# Altium schematic sheet PowerBoard.SchDoc
size A3; DocumentNumber: 5; SheetNumber: 5; SheetTotal: 9
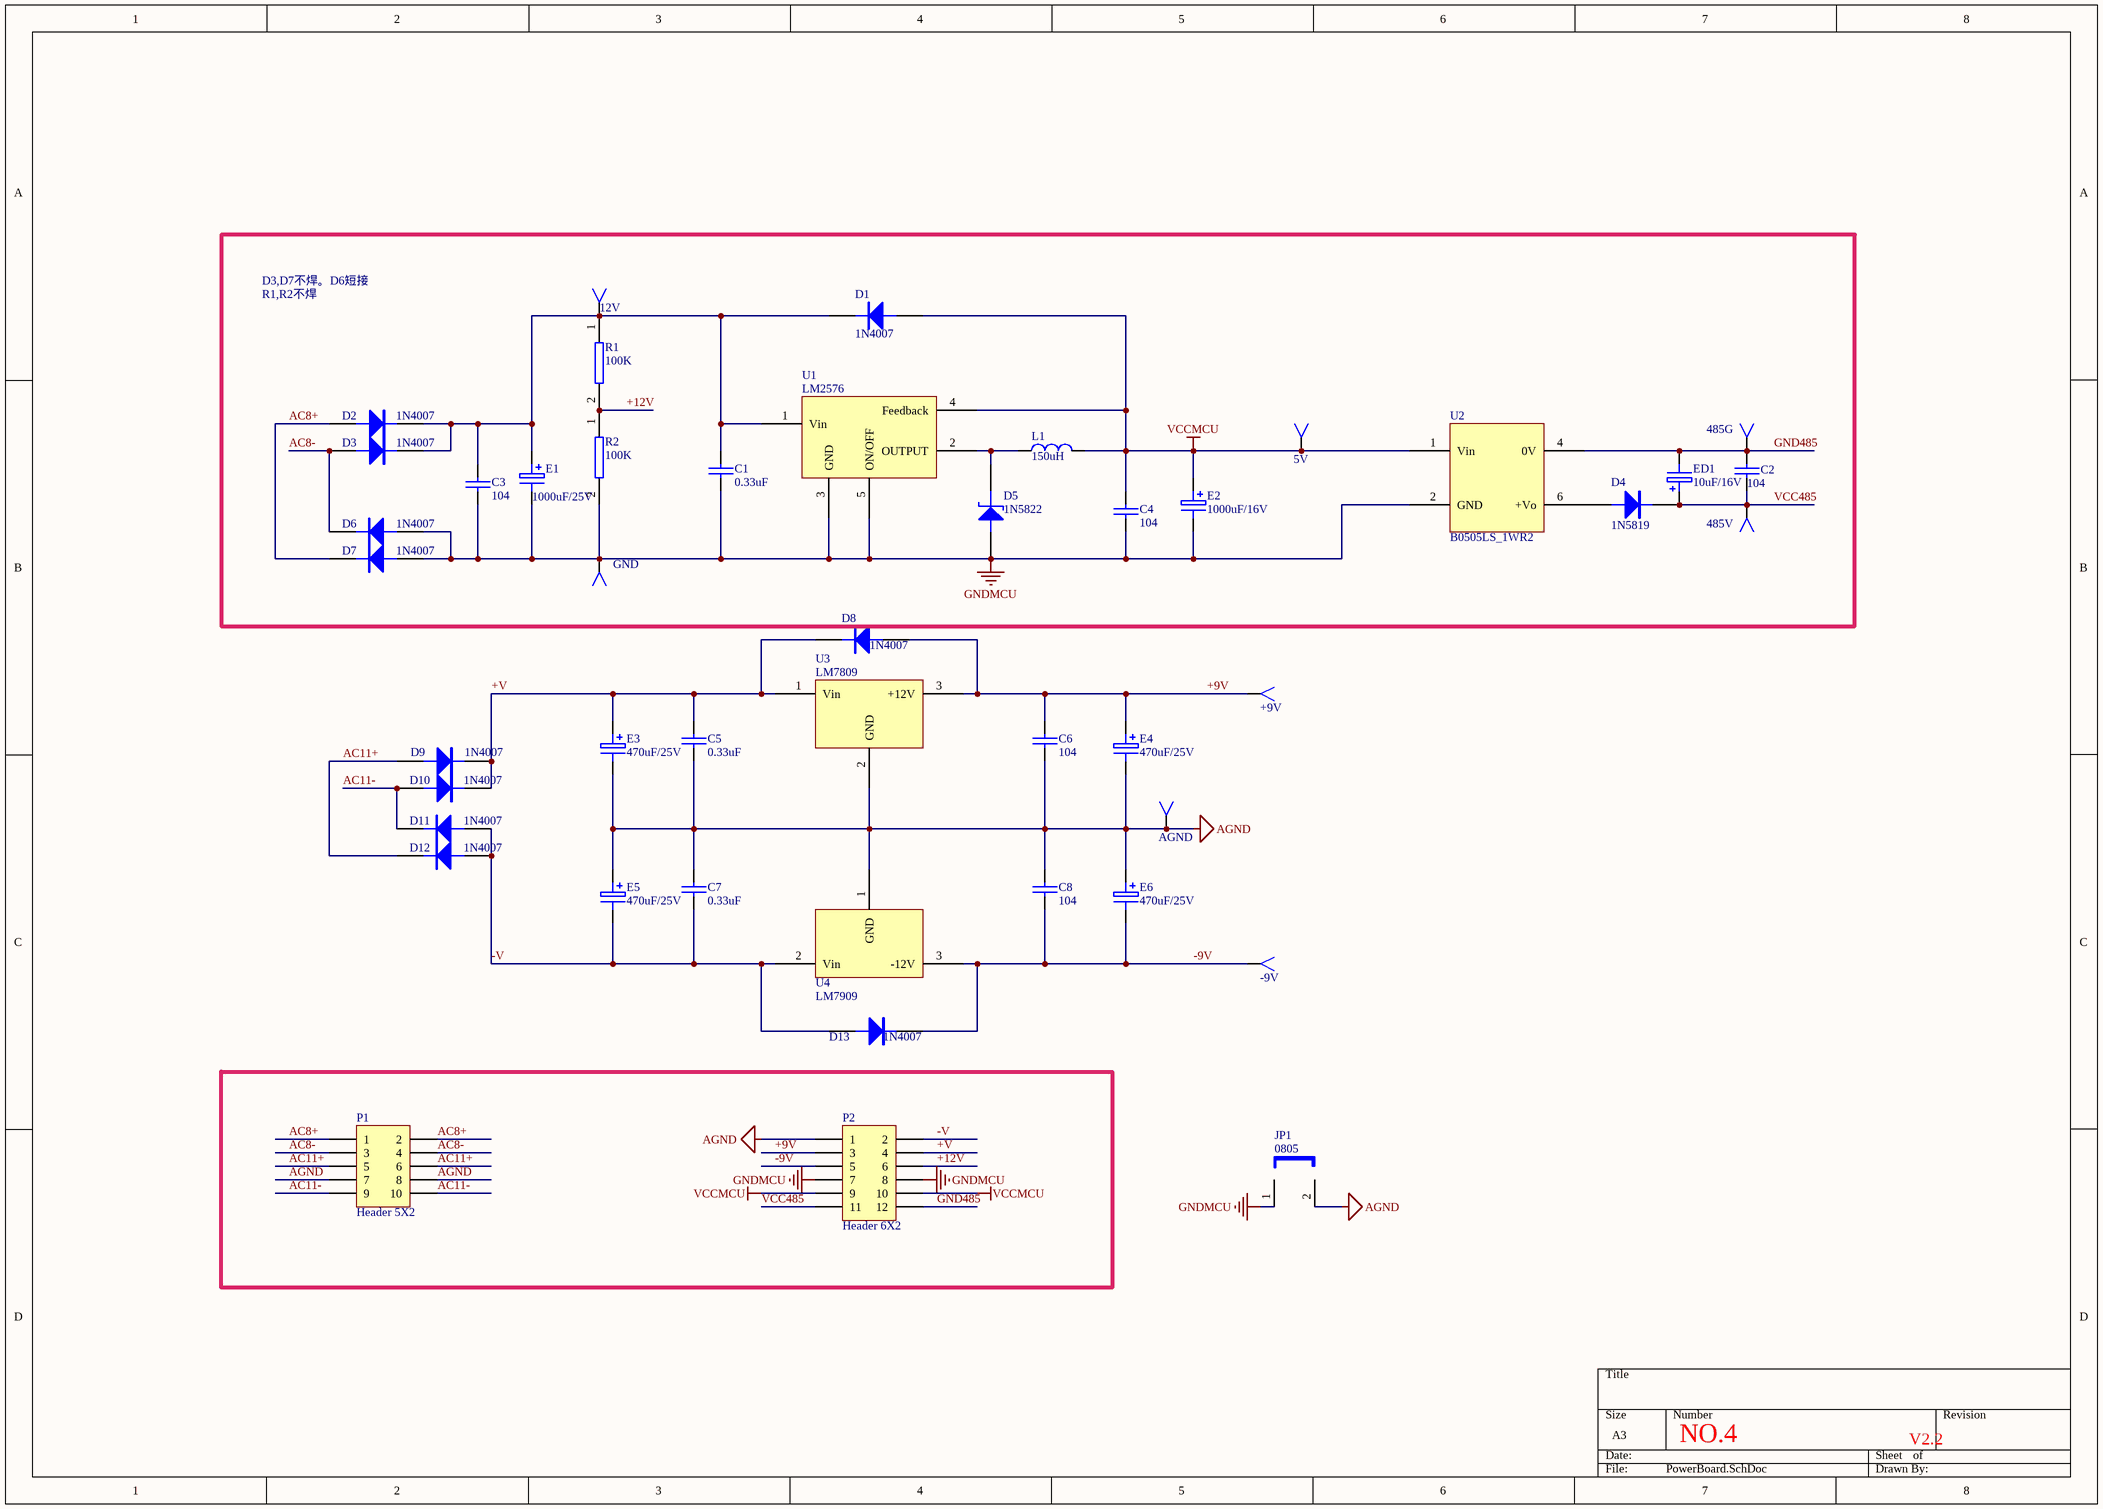
[diagram p0: PowerBoard.SchDoc]

## Parts
5V  TestPoint  [TestPoint_1.5]  (value not drawn)  (no BOM)
12V  TestPoint  [TestPoint_1.5]  (value not drawn)  (no BOM)
485G  TestPoint  [TestPoint_1.5]  (value not drawn)  (no BOM)
485V  TestPoint  [TestPoint_1.5]  (value not drawn)  (no BOM)
+9V  TestPoint  [TestPoint_1.5]  (value not drawn)  (no BOM)
-9V  TestPoint  [TestPoint_1.5]  (value not drawn)  (no BOM)
AGND  TestPoint  [TestPoint_1.5]  (value not drawn)  (no BOM)
C1  0.33uF  [CAP200]
C2  104  [0805/C2]
C3  104  [cap200]
C4  104  [cap200]
C5  0.33uF  [cap200]
C6  104  [cap200]
C7  0.33uF  [cap200]
C8  104  [cap200]
D1  1N4007  [DIODE0.3]
D2  1N4007  [DIODE0.3]
D3  1N4007  [DIODE0.3]
D4  1N5819  [DIODE0.3]
D5  1N5822  [SB540]
D6  1N4007  [DIODE0.3]
D7  1N4007  [DIODE0.3]
D8  1N4007  [DIODE0.3]
D9  1N4007  [DIODE0.3]
D10  1N4007  [DIODE0.3]
D11  1N4007  [DIODE0.3]
D12  1N4007  [DIODE0.3]
D13  1N4007  [DIODE0.3]
E1  1000uF/25V  [rb.2/.4]
E2  1000uF/16V  [rb.2/.4]
E3  470uF/25V  [C-220UF]
E4  470uF/25V  [C-220UF]
E5  470uF/25V  [C-220UF]
E6  470uF/25V  [C-220UF]
ED1  10uF/16V  [3528]
GND  TestPoint  [TestPoint_1.5]  (value not drawn)  (no BOM)
JP1  0805  [0805/R]
L1  150uH  [L-100UH]
P1  Header 5X2  [HDR2X5]
P2  Header 6X2  [HDR2X6]
R1  100K  [0805/R]
R2  100K  [0805/R]
U1  LM2576  [TO-263 - 5]
U2  B0505LS_1WR2  [B0505LS-1WR2]
U3  LM7809  [78XX]
U4  LM7909  [78XX]

## Nets
AGND: AGND.1 C5.2 C6.2 C7.1 C8.1 E3.2 E4.2 E5.1 E6.1 JP1.2 P1.7 P1.8 P2.1 U3.2(GND) U4.1(GND)
GNDMCU: C1.2 C3.2 C4.2 D5.1(A) D6.1(A) D7.1(A) E1.2 E2.2 GND.1 JP1.1 P2.7 P2.8 R2.2 U1.3(GND) U1.5(ON/OFF) U2.2(GND)
VCCMCU: 5V.1 C4.1 D1.1(A) E2.1 L1.2 P2.9 P2.10 U1.4(Feedback) U2.1(Vin)
+9V: +9V.1 C6.1 D8.1(A) E4.1 P2.3 U3.3(+12V)
+12V: P2.6 R1.2 R2.1
+V: C5.1 D8.2(K) D9.2(K) D10.2(K) E3.1 P2.4 U3.1(Vin)
-9V: -9V.1 C8.2 D13.2(K) E6.2 P2.5 U4.3(-12V)
-V: C7.2 D11.1(A) D12.1(A) D13.1(A) E5.2 P2.2 U4.2(Vin)
AC8+: D2.1(A) D7.2(K) P1.1 P1.2
AC8-: D3.1(A) D6.2(K) P1.3 P1.4
AC11+: D9.1(A) D12.2(K) P1.5 P1.6
AC11-: D10.1(A) D11.2(K) P1.9 P1.10
GND485: 485G.1 C2.1 ED1.2 P2.12 U2.4(0V)
VCC485: 485V.1 C2.2 D4.2(K) ED1.1 P2.11
Net12V_1: 12V.1 C1.1 C3.1 D1.2(K) D2.2(K) D3.2(K) E1.1 R1.1 U1.1(Vin)
NetD4_1: D4.1(A) U2.6(+Vo)
NetD5_2: D5.2(K) L1.1 U1.2(OUTPUT)

## Notes on the sheet
- D3,D7不焊。D6短接
- R1,R2不焊
- NO.4
- V2.2

## Library data of the parts
C1 C4-C8 = CAP
C2 C3 = CAP: Capacitor
D1-D4 D6-D13 = DIODE
D5 = ZENER2: Zener Diode
E1-E6 ED1 = ELECTRO1
JP1 = JUMPER
L1 = L
P1 = Header 5X2: Header, 5-Pin, Dual row; LatestRevisionDate: 17-Jul-2002; LatestRevisionNote: Re-released for DXP Platform.; Publisher: Altium Limited
P2 = Header 6X2: Header, 6-Pin, Dual row; LatestRevisionDate: 17-Jul-2002; LatestRevisionNote: Re-released for DXP Platform.; Publisher: Altium Limited
R1 R2 = RES2
U3 = MC7812T
U4 = MC7912T